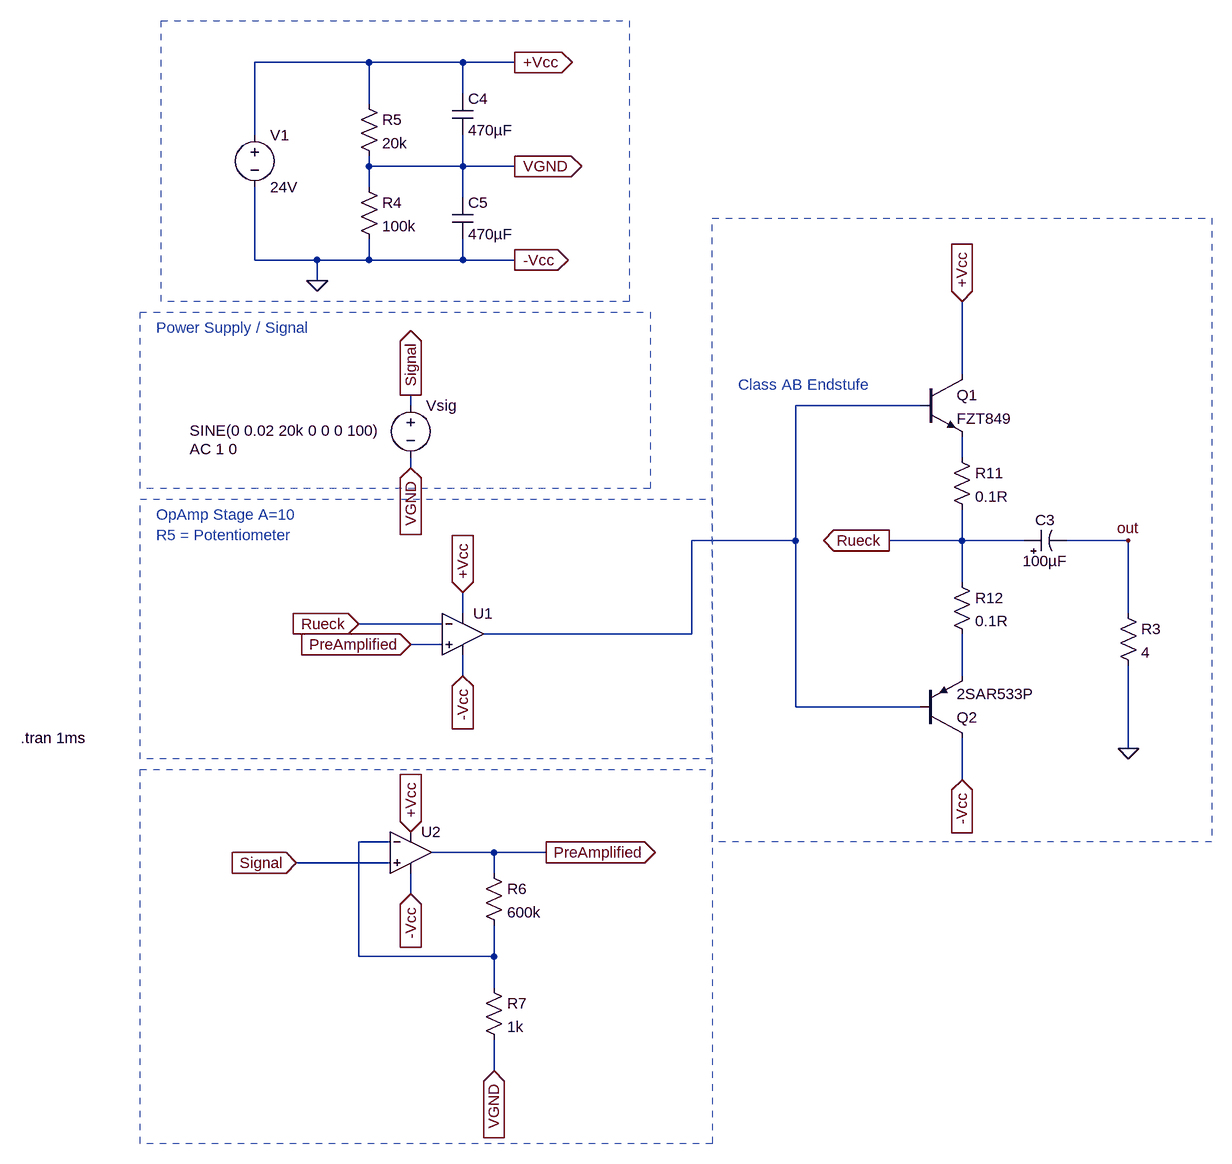
[diagram p0: schematic Verstaerker.asc]
Verstaerker.asc, the LTspice schematic file:
Version 4
SHEET 1 3716 1044
WIRE -288 -656 -464 -656
WIRE -144 -656 -288 -656
WIRE -64 -656 -144 -656
WIRE -144 -608 -144 -656
WIRE -288 -592 -288 -656
WIRE -464 -544 -464 -656
WIRE -288 -496 -288 -512
WIRE -144 -496 -144 -544
WIRE -144 -496 -288 -496
WIRE -64 -496 -144 -496
WIRE -288 -464 -288 -496
WIRE -144 -448 -144 -496
WIRE -464 -352 -464 -464
WIRE -368 -352 -464 -352
WIRE -288 -352 -288 -384
WIRE -288 -352 -368 -352
WIRE -144 -352 -144 -384
WIRE -144 -352 -288 -352
WIRE -64 -352 -144 -352
WIRE -368 -320 -368 -352
WIRE 624 -176 624 -288
WIRE -224 -128 -224 -144
WIRE 560 -128 368 -128
WIRE 624 -48 624 -80
WIRE -224 -32 -224 -48
WIRE 368 80 368 -128
WIRE 368 80 208 80
WIRE 624 80 624 32
WIRE 624 80 512 80
WIRE 720 80 624 80
WIRE 880 80 784 80
WIRE 624 144 624 80
WIRE -144 192 -144 160
WIRE 880 192 880 80
WIRE -176 208 -304 208
WIRE 208 224 208 80
WIRE 208 224 -112 224
WIRE -176 240 -224 240
WIRE -144 288 -144 256
WIRE 624 288 624 224
WIRE 368 336 368 80
WIRE 560 336 368 336
WIRE 880 400 880 272
WIRE 624 448 624 384
WIRE -256 544 -304 544
WIRE -96 560 -192 560
WIRE -16 560 -96 560
WIRE -256 576 -400 576
WIRE -96 592 -96 560
WIRE -224 624 -224 592
WIRE -304 720 -304 544
WIRE -96 720 -96 672
WIRE -96 720 -304 720
WIRE -96 768 -96 720
WIRE -96 896 -96 848
FLAG 624 -288 +Vcc
IOPIN 624 -288 In
FLAG 880 400 0
FLAG -224 -144 Signal
IOPIN -224 -144 Out
FLAG -144 160 +Vcc
IOPIN -144 160 In
FLAG -224 240 PreAmplified
IOPIN -224 240 In
FLAG -144 288 -Vcc
IOPIN -144 288 In
FLAG 624 448 -Vcc
IOPIN 624 448 In
FLAG 512 80 Rueck
IOPIN 512 80 Out
FLAG -304 208 Rueck
IOPIN -304 208 In
FLAG -368 -320 0
FLAG -64 -656 +Vcc
IOPIN -64 -656 Out
FLAG -64 -496 VGND
IOPIN -64 -496 Out
FLAG -64 -352 -Vcc
IOPIN -64 -352 Out
FLAG -224 -32 VGND
IOPIN -224 -32 In
FLAG -224 528 +Vcc
IOPIN -224 528 In
FLAG -224 624 -Vcc
IOPIN -224 624 In
FLAG -96 896 VGND
IOPIN -96 896 In
FLAG -16 560 PreAmplified
IOPIN -16 560 Out
FLAG -400 576 Signal
IOPIN -400 576 In
FLAG 880 80 out
SYMBOL voltage -224 -144 R0
WINDOW 3 -340 55 Left 2
WINDOW 123 -340 83 Left 2
WINDOW 39 0 0 Left 0
SYMATTR Value SINE(0 0.02 20k 0 0 0 100)
SYMATTR Value2 AC 1 0
SYMATTR InstName Vsig
SYMBOL pnp 560 384 M180
SYMATTR InstName Q2
SYMATTR Value 2SAR533P
SYMBOL res 864 176 R0
SYMATTR InstName R3
SYMATTR Value 4
SYMBOL polcap 720 96 R270
WINDOW 0 32 32 VTop 2
WINDOW 3 0 32 VBottom 2
SYMATTR InstName C3
SYMATTR Value 100µF
SYMBOL OpAmps\\UniversalOpamp2 -144 224 R0
SYMATTR InstName U1
SYMBOL npn 560 -176 R0
SYMATTR InstName Q1
SYMATTR Value FZT849
SYMBOL voltage -464 -560 R0
WINDOW 123 0 0 Left 0
WINDOW 39 0 0 Left 0
SYMATTR InstName V1
SYMATTR Value 24V
SYMBOL res -304 -480 R0
SYMATTR InstName R4
SYMATTR Value 100k
SYMBOL res -304 -608 R0
SYMATTR InstName R5
SYMATTR Value 20k
SYMBOL OpAmps\\UniversalOpamp2 -224 560 R0
SYMATTR InstName U2
SYMBOL res -112 576 R0
SYMATTR InstName R6
SYMATTR Value 600k
SYMBOL res -112 752 R0
SYMATTR InstName R7
SYMATTR Value 1k
SYMBOL res 608 -64 R0
SYMATTR InstName R11
SYMATTR Value 0.1R
SYMBOL res 608 128 R0
SYMATTR InstName R12
SYMATTR Value 0.1R
SYMBOL cap -160 -608 R0
SYMATTR InstName C4
SYMATTR Value 470µF
SYMBOL cap -160 -448 R0
SYMATTR InstName C5
SYMATTR Value 470µF
TEXT -824 384 Left 2 !.tran 1ms
TEXT -616 40 Left 2 ;OpAmp Stage A=10\nR5 = Potentiometer
TEXT -616 -248 Left 2 ;Power Supply / Signal
TEXT 280 -160 Left 2 ;Class AB Endstufe
RECTANGLE Normal 240 416 -640 16 2
RECTANGLE Normal 144 0 -640 -272 2
RECTANGLE Normal 240 1008 -640 432 2
RECTANGLE Normal 112 -288 -608 -720 2
RECTANGLE Normal 1008 544 240 -416 2

The netlist it stands for:
* Verstaerker.asc
Vsig Signal VGND SINE(0 0.02 20k 0 0 0 100) AC 1 0
Q2 0 N001 N003 0 2SAR533P
R3 out 0 4
C3 Rueck out 100µF
XU1 PreAmplified Rueck +Vcc 0 N001 level.2 Avol=1Meg GBW=10Meg Slew=10Meg ilimit=25m rail=0 Vos=0 phimargin=45 en=0 enk=0 in=0 ink=0 Rin=500Meg  ; pins IN+ IN- V+ V- OUT
Q1 +Vcc N001 N002 0 FZT849
V1 +Vcc 0 24V
R4 VGND 0 100k
R5 +Vcc VGND 20k
XU2 Signal N004 +Vcc 0 PreAmplified level.2 Avol=1Meg GBW=10Meg Slew=10Meg ilimit=25m rail=0 Vos=0 phimargin=45 en=0 enk=0 in=0 ink=0 Rin=500Meg  ; pins IN+ IN- V+ V- OUT
R6 PreAmplified N004 600k
R7 N004 VGND 1k
R11 N002 Rueck 0.1R
R12 Rueck N003 0.1R
C4 +Vcc VGND 470µF
C5 VGND 0 470µF
.model NPN NPN
.model PNP PNP
.lib standard.bjt
.tran 1ms
* OpAmp Stage A=10
* R5 = Potentiometer
* Power Supply / Signal
* Class AB Endstufe
.lib UniversalOpamps2.sub
.backanno
.end